# Altium schematic sheet Boost.SchDoc: Battery Charger Boost Converter
size A4; DocumentNumber: 3; Revision: 0v1; SheetNumber: 3; SheetTotal: 9
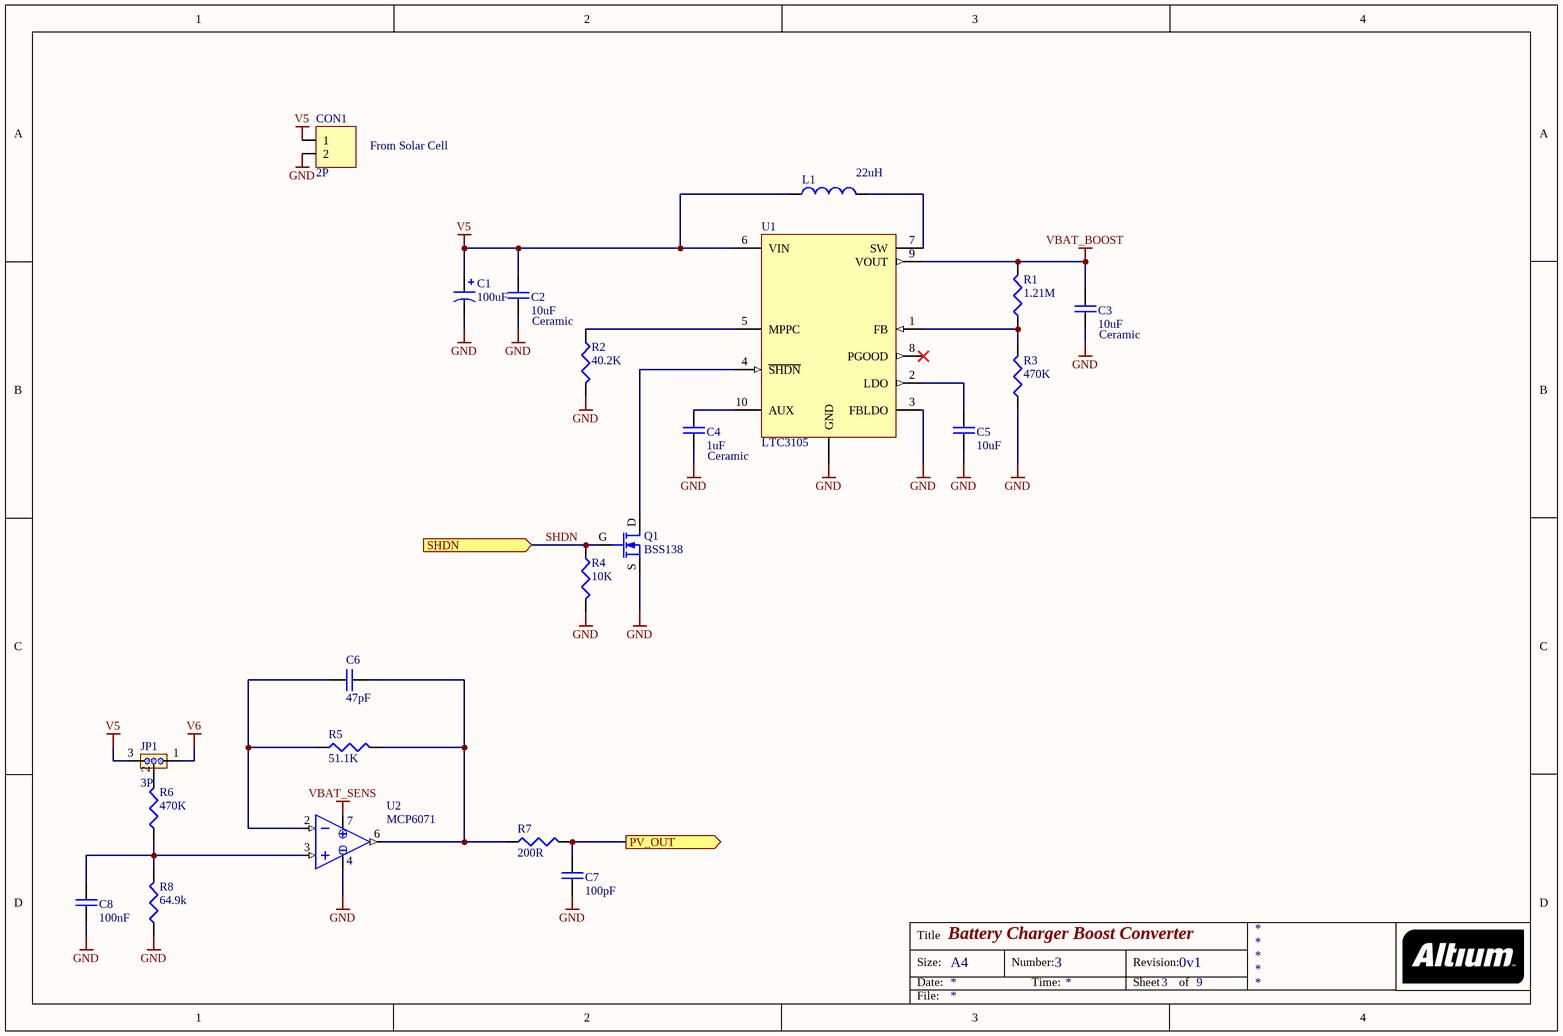
[diagram p0: Boost.SchDoc]

## Parts
C1  100uF  [RADIAL-5MM]
C2  10uF  [0805]
C3  10uF  [0805]
C4  1uF  [0603]
C5  10uF  [0805]
C6  47pF  [0603]
C7  100pF  [0603]
C8  100nF  [0603]
CON1  2P  [JST-2MM]
JP1  3P  [SIP-3]
L1  22uH  [7X7]
Q1  BSS138  [SOT-23@GSD]
R1  1.21M  [0603]
R2  40.2K  [0603]
R3  470K  [0603]
R4  10K  [0603]
R5  51.1K  [0603]
R6  470K  [0603]
R7  200R  [0603]
R8  64.9k  [0603]
U1  LTC3105  [DFN-10]
U2  MCP6071  [SOIC-8]

## Ports
PV_OUT (out), SHDN (in)

## Nets
GND: C1.2(N) C2.1 C3.1 C4.1 C5.1 C7.1 C8.1 CON1.2 Q1.S R2.2 R3.1 R4.2 R8.1 U1.3(FBLDO) U1.PAD(GND) U2.4(VSS)
V5: C1.1(P) C2.2 CON1.1 JP1.3 L1.1 U1.6(VIN)
V6: JP1.1
VBAT_BOOST: C3.2 R1.2 U1.9(VOUT)
VBAT_SENS: U2.7(VDD)
PV_OUT: C7.2 R7.2 ; port PV_OUT
SHDN: Q1.G R4.1 ; port SHDN
NetC4_2: C4.2 U1.10(AUX)
NetC5_2: C5.2 U1.2(LDO)
NetC6_1: C6.1 R5.1 U2.2(INN)
NetC6_2: C6.2 R5.2 R7.1 U2.6(VOUT)
NetC8_2: C8.2 R6.1 R8.2 U2.3(INP)
NetJP1_2: JP1.2 R6.2
NetL1_2: L1.2 U1.7(SW)
NetQ1_D: Q1.D U1.4(~{SHDN})
NetR1_1: R1.1 R3.2 U1.1(FB)
NetR2_1: R2.1 U1.5(MPPC)

Not connected (* = marked no-connect by the designer): U1 8(PGOOD)*

## Notes on the sheet
- From Solar Cell
- Ceramic
- (near C3) Ceramic
- Title
- Size:
- Date:
- A4
- Number:
- Time:
- Revision:
- Sheet
- of
- File:

## Library data of the parts
C1 = CAP POL: Polarized Capacitor; Owner: Nuno Brum; Sub-Type: Tantalum; Assembly: INS; Validation date: 2006-05-15; Creation Date: 2005-04-28; Status: Valid; Type: Capacitor
C2-C8 = CAP: Capacitor; Owner: Nuno Brum; Sub-Type: Ceramic; Assembly: INS; Maximum Voltage: *; Creation Date: 2005-04-28; Status: Valid; Validation date: 2006-05-15; Type: Capacitor
CON1 = CON02: Connector 2 pins; Owner: Rui Rebelo; Assembly: INS; Sub-Type: Connector; Creation Date: 2005-05-27; Status: Valid; Validation Date: 2006-05-15; Type: Electrical & Mechanical
JP1 = JMP3: 3-Jumper; Owner: Nuno Brum; Sub-Type: Connector; STATE1: 0; Assembly: INS; Validation Date: 2006-05-15; Creation Date: 2002-07-17; Status: Valid; Type: Electrical & Mechanical
L1 = IND: Inductor; Owner: Nuno Brum; Sub-Type: Generic; Assembly: INS; Validation date: 2006-05-15; Creation Date: 2002-07-17; Status: Valid; Type: Inductor
Q1 = MOSFET-N: N-Channel Logic Level Enhancement Mode Field Effect Transistor; pin to pad: 2>3 3>2; Owner: Nuno Brum; Sub-Type: MOSFET; Assembly: INS; Creation Date: 2001-06-05; Status: Valid; Model: BSS138; Type: Transistor
R1-R8 = RES: Resistor; Owner: Nuno Brum; Sub-Type: Generic; Assembly: INS; Validation date: 2006-05-15; Creation Date: 2002-07-17; Status: Valid; Power: *; Type: Resistor
U1 = LTC3105: 400mA Step-Up DCDC Converter With MPPC and 250mV Start-Up; Type: IC; Creation Date: 2012-03-14
U2 = MCP6V26: Low-Offset Opamp; Type: IC; Creation Date: 2012-03-15